# EAGLE schematic STM-Boy (EAGLE 9.6.1)

## Sheet 1 of 2
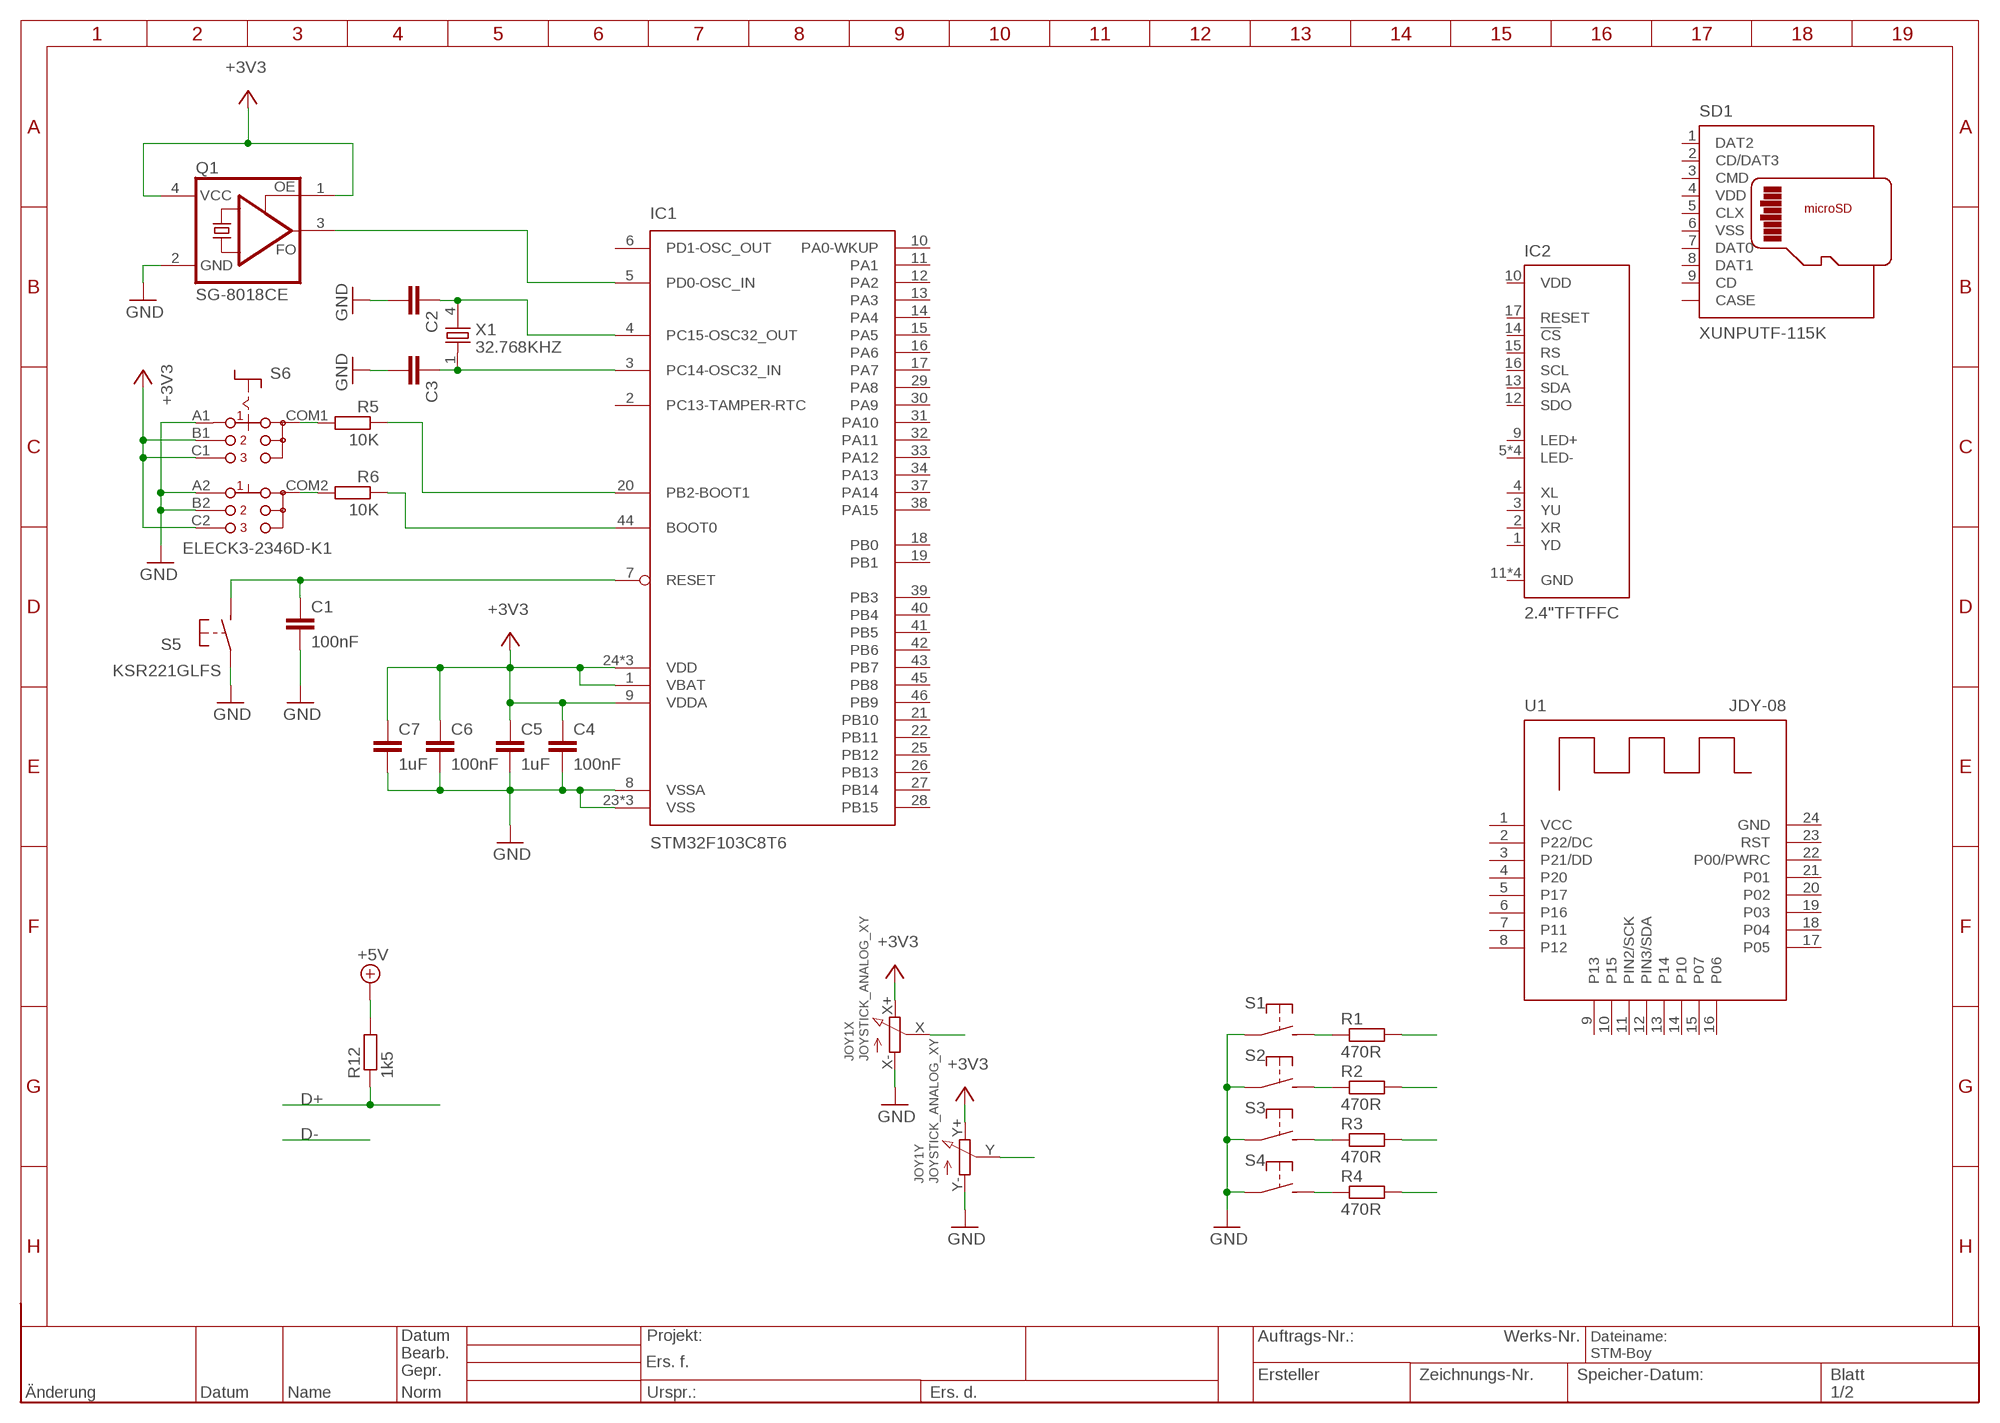
[diagram p0: schematic, sheet 1]

### Parts
C1  100nF  C-EUC0805  [C0805]
C2  C-EUC0805  [C0805]
C3  C-EUC0805  [C0805]
C4  100nF  C-EUC0805  [C0805]
C5  1uF  C-EUC0805  [C0805]
C6  100nF  C-EUC0805  [C0805]
C7  1uF  C-EUC0805  [C0805]
IC1  STM32F103C8T6  [LQFP48]
IC2  2.4"TFTFFC  [FPC_18]
JOY1  JOYSTICK_ANALOG_XY  [JOYSTICK_ANALOG_MINITHM]
Q1  SG-8018CE  [SMD-3225]
R1  470R  R-EU_R0805  [R0805]
R2  470R  R-EU_R0805  [R0805]
R3  470R  R-EU_R0805  [R0805]
R4  470R  R-EU_R0805  [R0805]
R5  10K  R-EU_R0805  [R0805]
R6  10K  R-EU_R0805  [R0805]
R12  1k5  R-EU_R0805  [R0805]
S1  8MM_SOFT_BUTTON  [8MM_BUTTON]
S2  8MM_SOFT_BUTTON  [8MM_BUTTON]
S3  8MM_SOFT_BUTTON  [8MM_BUTTON]
S4  8MM_SOFT_BUTTON  [8MM_BUTTON]
S5  KSR221GLFS  [KSR211GLFS]
S6  ELECK3-2346D-K1  [ELECK3-2346D-K1]
SD1  XUNPUTF-115K  [XUNPUTF-115K]
U1  JDY-08  [JDY-08]
X1  32.768KHZ  [SMD-6914]

### Nets
+3V3: C4.1 C5.1 C6.1 C7.1 IC1.1(VBAT) IC1.9(VDDA) IC1.24(VDD) IC1.36(VDD) IC1.48(VDD) JOY1.X+(X:E) JOY1.Y+(Y:E) Q1.1(OE) Q1.4(VCC) S6.B1(A2) S6.C1(A3) S6.C2(B3)
+5V: R12.2
D+: R12.1
GND: C1.2 C2.2 C3.2 C4.2 C5.2 C6.2 C7.2 IC1.8(VSSA) IC1.23(VSS) IC1.35(VSS) IC1.47(VSS) JOY1.X-(X:A) JOY1.Y-(Y:A) Q1.2(GND) S1.1 S1.2 S2.1 S2.2 S3.1 S3.2 S4.1 S4.2 S5.1 S6.A1 S6.A2(B1) S6.B2 ; also sheet 2
N$1: C1.1 IC1.7(RESET) S5.2(S)
N$2: R1.1 S1.3(S) S1.4(S)
N$3: R2.1 S2.3(S) S2.4(S)
N$4: R3.1 S3.3(S) S3.4(S)
N$5: R4.1 S4.3(S) S4.4(S)
N$6: R1.2
N$7: R2.2
N$8: R3.2
N$9: R4.2
N$10: JOY1.Y(Y:S)
N$11: JOY1.X(X:S)
N$12: IC1.5(PD0-OSC_IN) Q1.3(FO)
N$13: IC1.20(PB2-BOOT1) R5.1
N$14: R5.2 S6.COM1(A)
N$15: R6.2 S6.COM2(B)
N$16: C2.1 IC1.4(PC15-OSC32_OUT) X1.4
N$17: C3.1 IC1.3(PC14-OSC32_IN) X1.1
N$18: IC1.44(BOOT0) R6.1
Unconnected: IC1.2(PC13-TAMPER-RTC) IC1.6(PD1-OSC_OUT) IC1.10(PA0-WKUP) IC1.11(PA1) IC1.12(PA2) IC1.13(PA3) IC1.14(PA4) IC1.15(PA5) IC1.16(PA6) IC1.17(PA7) IC1.18(PB0) IC1.19(PB1) IC1.21(PB10) IC1.22(PB11) IC1.25(PB12) IC1.26(PB13) IC1.27(PB14) IC1.28(PB15) IC1.29(PA8) IC1.30(PA9) IC1.31(PA10) IC1.32(PA11) IC1.33(PA12) IC1.34(PA13) IC1.37(PA14) IC1.38(PA15) IC1.39(PB3) IC1.40(PB4) IC1.41(PB5) IC1.42(PB6) IC1.43(PB7) IC1.45(PB8) IC1.46(PB9) IC2.1(YD) IC2.2(XR) IC2.3(YU) IC2.4(XL) IC2.5(LED-) IC2.6(LED-) IC2.7(LED-) IC2.8(LED-) IC2.9(LED+) IC2.10(VDD) IC2.11(GND) IC2.12(SDO) IC2.13(SDA) IC2.14(!CS) IC2.15(RS) IC2.16(SCL) IC2.17(RESET) IC2.18(GND) IC2.MOUNT1(GND) IC2.MOUNT2(GND) SD1.1(DAT2) SD1.2(CD/DAT3) SD1.3(CMD) SD1.4(VDD) SD1.5(CLX) SD1.6(VSS) SD1.7(DAT0) SD1.8(DAT1) SD1.9(CD) SD1.CASE_1(CASE) SD1.CASE_2(CASE) SD1.CASE_3(CASE) SD1.CASE_4(CASE) U1.1(VCC) U1.2(P22/DC) U1.3(P21/DD) U1.4(P20) U1.5(P17) U1.6(P16) U1.7(P11) U1.8(P12) U1.9(P13) U1.10(P15) U1.11(PIN2/SCK) U1.12(PIN3/SDA) U1.13(P14) U1.14(P10) U1.15(P07) U1.16(P06) U1.17(P05) U1.18(P04) U1.19(P03) U1.20(P02) U1.21(P01) U1.22(P00/PWRC) U1.23(RST) U1.24(GND)

## Sheet 2 of 2
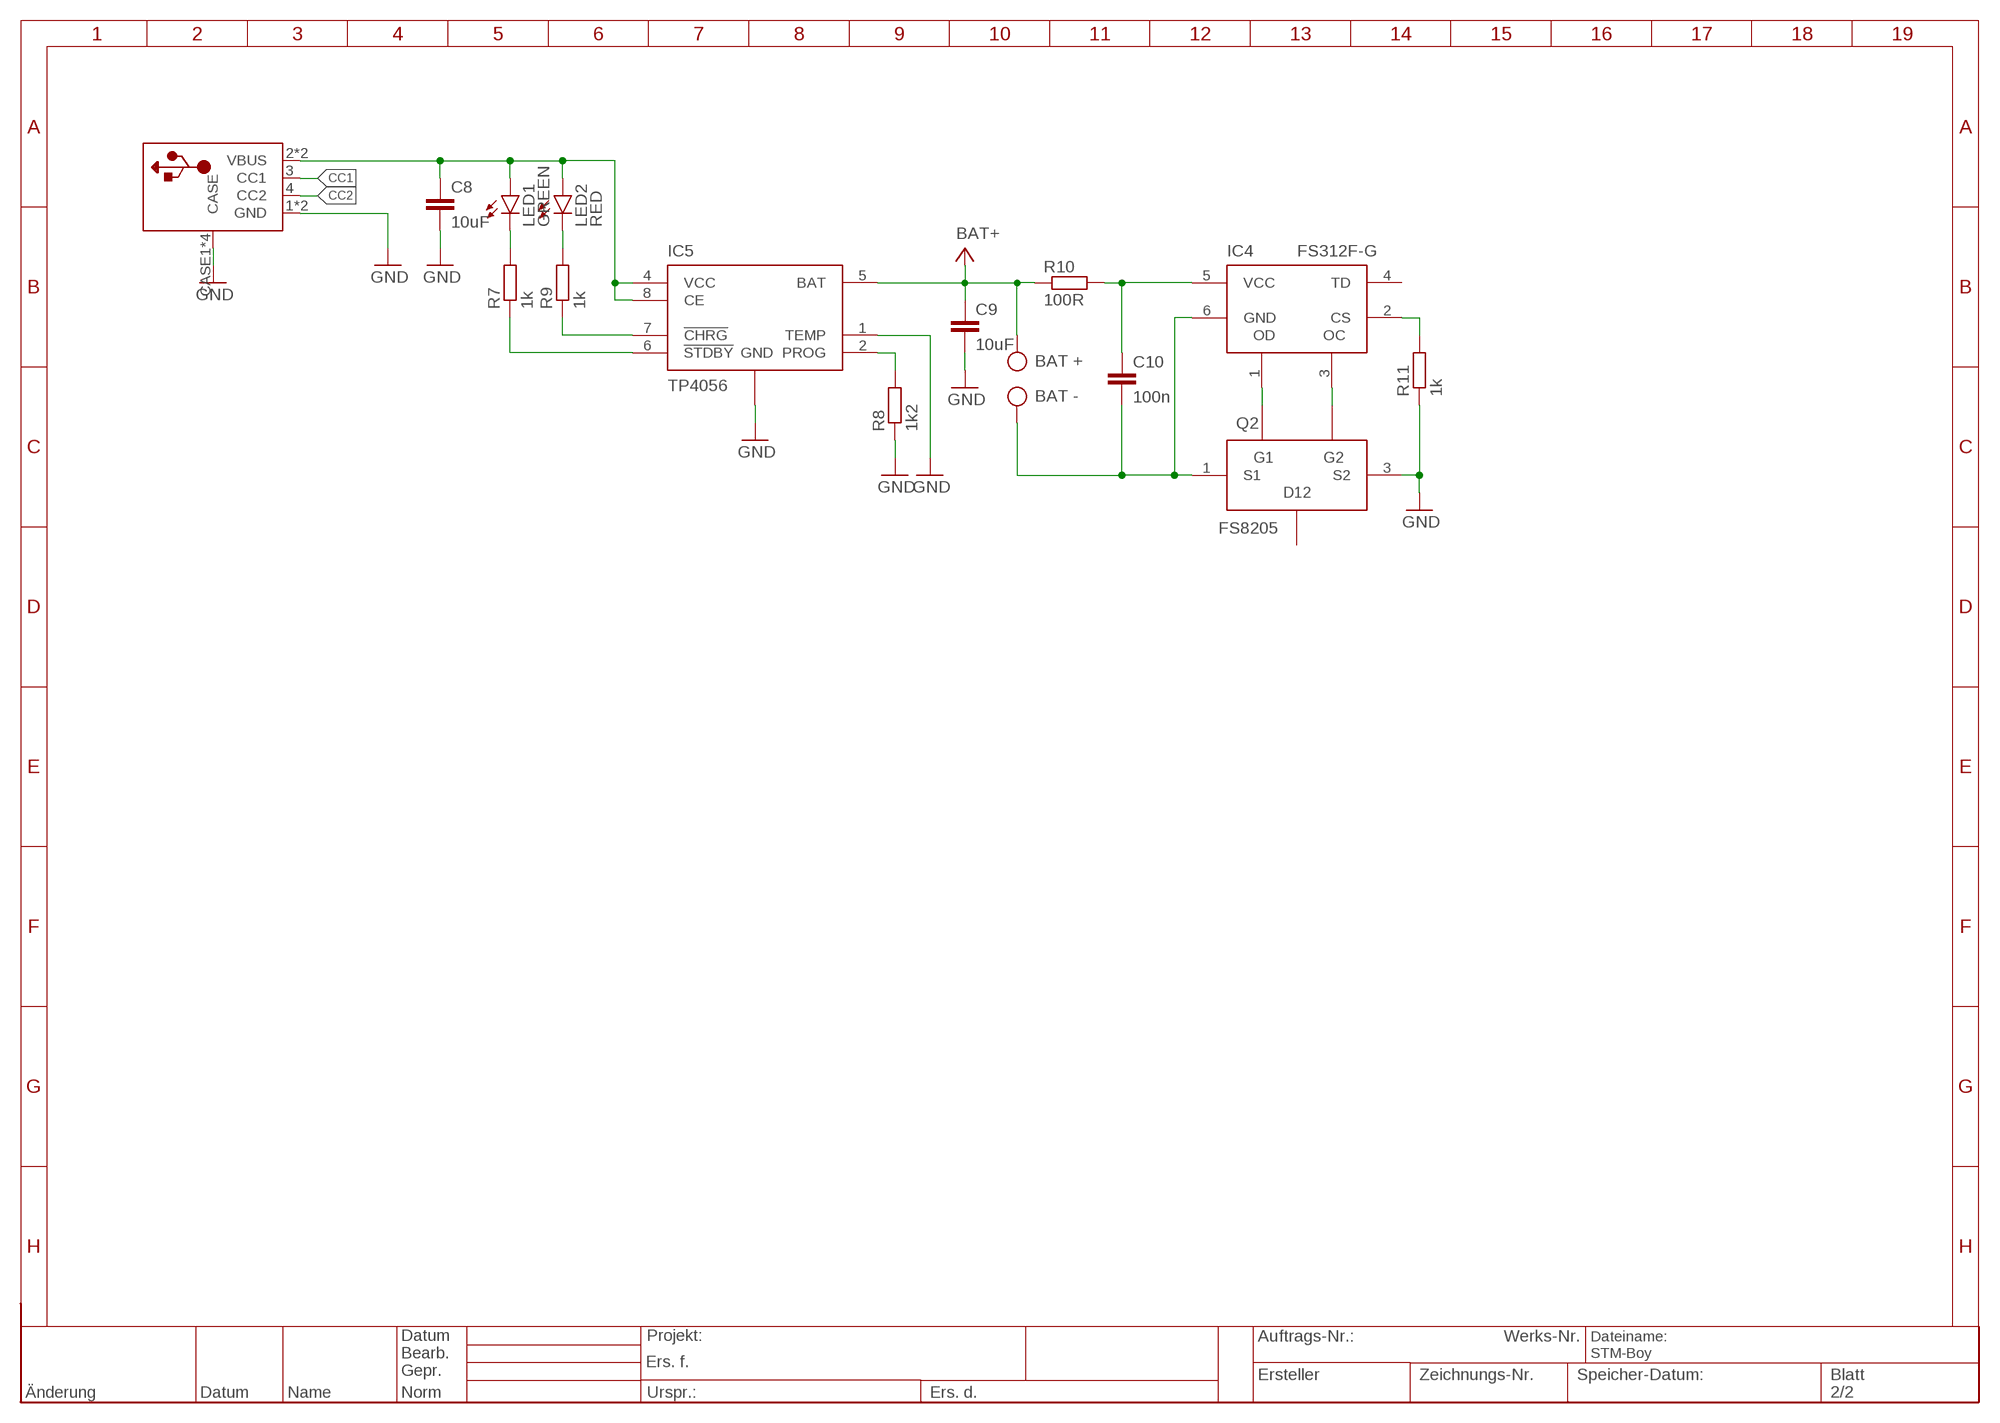
[diagram p1: schematic, sheet 2]

### Parts
C8  10uF  C-EUC0805  [C0805]
C9  10uF  C-EUC0805  [C0805]
C10  100n  C-EUC0805  [C0805]
IC4  FS312F-G  [SOT-23-6]
IC5  TP4056  [SOP-8]
J1  USB-C_CON  [USB-C6PIN]
J4  BAT +  CON-PAD  [CON-PAD]
J5  BAT -  CON-PAD  [CON-PAD]
LED1  GREEN  LEDCHIPLED_0603  [CHIPLED_0603]
LED2  RED  LEDCHIPLED_0603  [CHIPLED_0603]
Q2  FS8205  [SOT-23-6]
R7  1k  R-EU_R0805  [R0805]
R8  1k2  R-EU_R0805  [R0805]
R9  1k  R-EU_R0805  [R0805]
R10  100R  R-EU_R0805  [R0805]
R11  1k  R-EU_R0805  [R0805]

### Nets
BAT+: C9.1 IC5.5(BAT) J4.1 R10.1
BAT-: C10.2 IC4.6(GND) J5.1 Q2.1(S1)
CC1: J1.3(CC1)
CC2: J1.4(CC2)
GND: C8.2 C9.2 IC5.1(TEMP) IC5.3(GND) IC5.9(GND) J1.1(GND) J1.6(GND) J1.CASE1(CASE) J1.CASE2(CASE) J1.CASE3(CASE) J1.CASE4(CASE) Q2.3(S2) R8.1 R11.1 ; also sheet 1
N$19: LED1.C R7.2
N$20: LED2.C R9.2
N$21: IC5.2(PROG) R8.2
N$22: IC5.7(!CHRG) R9.1
N$23: IC5.6(!STDBY) R7.1
N$24: IC4.1(OD) Q2.6(G1)
N$25: IC4.3(OC) Q2.4(G2)
N$26: IC4.2(CS) R11.2
N$27: C10.1 IC4.5(VCC) R10.2
VBUS: C8.1 IC5.4(VCC) IC5.8(CE) J1.2(VBUS) J1.5(VBUS) LED1.A LED2.A
Unconnected: IC4.4(TD) Q2.2(D12) Q2.5(D12)

## Library data of the parts
C1-C10 = rcl:C-EU: CAPACITOR, European symbol; SPICEPREFIX: C
IC1 = Jakobs_LBR:STM32F103C8T6
IC2 = Jakobs_LBR:2.4"TFT
IC4 = Jakobs_LBR:FS312F-G: One Cell Lithium-ion/Polymer Battery Protection IC Source: Datasheet <https://www.ic-fortune.com/upload/Download/FS312F-G-DS-12_EN.pdf>; DESCRIPTION: One Cell Lithium-ion/Polymer Battery Protection IC; HEIGHT: 1.45mm; MANUFACTURER_NAME: Fortune Semiconductor Corporation; MANUFACTURER_PART_NUMBER: FS312F-G
IC5 = Jakobs_LBR:TP4056: 1A Standalone Linear Li-lon Battery Charger, SOP-8 Source: Datasheet <https://dlnmh9ip6v2uc.cloudfront.net/datasheets/Prototyping/TP4056.pdf>; DESCRIPTION: 1A Standalone Linear Li-lon Battery Charger, SOP-8; HEIGHT: 1.75mm; MANUFACTURER_NAME: NanJing Top Power; MANUFACTURER_PART_NUMBER: TP4056
J1 = Jakobs_LBR:USB-C_CON: 6 pin usb-c to use with older usb 2.0 interface
J4 J5 = Jakobs_LBR:CON-PAD
JOY1 = Jakobs_LBR:JOYSTICK_ANALOG_XY
LED1 LED2 = led:LED: LED OSRAM: - CHIPLED LG R971, LG N971, LY N971, LG Q971, LY Q971, LO R971, LY R971 LH N974, LH R974 LS Q976, LO Q976, LY Q976 LO Q996 - Hyper CHIPLED LW Q18S LB Q993, LB Q99A, LB R99A - SideLED LS A670, LO A670, LY A670, LG A670, LP A670 LB A673, LV A673, LT A673, LW A673 LH A674 LY A675 LS A676, LA A676, LO A676, LY A676, LW A676 LS A679, LY A679, LG A679 - Hyper Micro SIDELED® LS Y876, LA Y876, LO Y876, LY Y876 LT Y87S - SmartLED LW L88C, LW L88S LB L89C, LB L89S, LG L890 LS L89K, LO L89K, LY L89K LS L896, LA L896, LO L896, LY L896 - TOPLED LS T670, LO T670, LY T670, LG T670, LP T670 LSG T670, LSP T670, LSY T670, LOP T670, LYG T670 LG T671, LOG T671, LSG T671 LB T673, LV T673, LT T673, LW T673 LH T674 LS T676, LA T676, LO T676, LY T676, LB T676, LH T676, LSB T676, LW T676 LB T67C, LV T67C, LT T67C, LS T67K, LO T67K, LY T67K, LW E67C LS E67B, LA E67B, LO E67B, LY E67B, LB E67C, LV E67C, LT E67C LW T67C LS T679, LY T679, LG T679 LS T770, LO T770, LY T770, LG T770, LP T770 LB T773, LV T773, LT T773, LW T773 LH T774 LS E675, LA E675, LY E675, LS T675 LS T776, LA T776, LO T776, LY T776, LB T776 LHGB T686 LT T68C, LB T68C - Hyper Mini TOPLED® LB M676 - Mini TOPLED Santana® LG M470 LS M47K, LO M47K, LY M47K Source: http://www.osram.convergy.de LUXEON: - LUMILED® LXK2-PW12-R00, LXK2-PW12-S00, LXK2-PW14-U00, LXK2-PW14-V00 LXK2-PM12-R00, LXK2-PM12-S00, LXK2-PM14-U00 LXK2-PE12-Q00, LXK2-PE12-R00, LXK2-PE12-S00, LXK2-PE14-T00, LXK2-PE14-U00 LXK2-PB12-K00, LXK2-PB12-L00, LXK2-PB12-M00, LXK2-PB14-N00, LXK2-PB14-P00, LXK2-PB14-Q00 LXK2-PR12-L00, LXK2-PR12-M00, LXK2-PR14-Q00, LXK2-PR14-R00 LXK2-PD12-Q00, LXK2-PD12-R00, LXK2-PD12-S00 LXK2-PH12-R00, LXK2-PH12-S00 LXK2-PL12-P00, LXK2-PL12-Q00, LXK2-PL12-R00 Source: www.luxeon.com KINGBRIGHT: KA-3528ASYC Source: www.kingbright.com
Q1 = Jakobs_LBR:SG-8018CE: 72MHz ±50ppm 1.8V ~ 3.3V SMD-3225_4P SMD Oscillators(XO) RoHS; FREQUENCY: 72MHz; F_STABILITY: +/-50ppm; SUPPLY_VOLTAGE: 1.8V-3.3V
Q2 = Jakobs_LBR:FS8205: DUAL N-CHANNEL ENHANCEMENT MODE POWER MOFSET Source: Datasheet <https://www.ic-fortune.com/upload/Download/FS8205-DS-19_EN.pdf>; DESCRIPTION: DUAL N-CHANNEL ENHANCEMENT MODE POWER MOFSET; HEIGHT: 1mm; MANUFACTURER_NAME: Fortune Semiconductor Corporation; MANUFACTURER_PART_NUMBER: FS8205
R1-R12 = rcl:R-EU_: RESISTOR, European symbol; SPICEPREFIX: R
S1-S4 = Jakobs_LBR:8MM_SOFT_BUTTON
S5 = Jakobs_LBR:KSR221GLFS: KSR221GLFS (Tactile Switches) Source: Datasheet <https://www.ckswitches.com/media/1466/ksr.pdf>; ARROW_PART_NUMBER: KSR221GLFS; ARROW_PRICE/STOCK: https://www.arrow.com/en/products/ksr221glfs/ck; DESCRIPTION: KSR221GLFS (Tactile Switches); HEIGHT: mm; MANUFACTURER_NAME: C & K COMPONENTS; MANUFACTURER_PART_NUMBER: KSR221GLFS
S6 = Jakobs_LBR:ELECK3-2346D-K1
SD1 = Jakobs_LBR:XUNPUTF-115K: microSD™ Memory Card 8 connector&Ejector 14.5x14.75x1.85mm Card Sockets Connectors RoHS; HEIGHT: 1.8-2.0mm
U1 = Jakobs_LBR:JDY-08: Bluetooth BLE 4.0 CC2541 Module
X1 = Jakobs_LBR:32.768KHZ: 32.768KHz ±20ppm 12.5pF 65kΩ SMD-6914 SMD Crystal Resonators RoHS

## Net classes
0 default: width 0.089 mm, drill 0.2 mm, clearance 0.089 mm